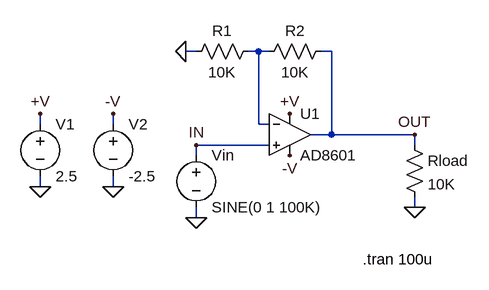
[diagram p0: schematic AD8601.asc]
AD8601.asc, the LTspice schematic file:
Version 4
SHEET 1 1240 700
WIRE 448 -1104 432 -1104
WIRE 544 -1104 528 -1104
WIRE 560 -1104 544 -1104
WIRE 656 -1104 640 -1104
WIRE 208 -992 208 -1008
WIRE 320 -992 320 -1008
WIRE 544 -992 544 -1104
WIRE 560 -992 544 -992
WIRE 656 -976 656 -1104
WIRE 656 -976 624 -976
WIRE 784 -976 656 -976
WIRE 560 -960 448 -960
WIRE 784 -960 784 -976
WIRE 448 -944 448 -960
WIRE 208 -896 208 -912
WIRE 320 -896 320 -912
WIRE 784 -864 784 -880
WIRE 448 -848 448 -864
FLAG 208 -1008 +V
FLAG 208 -896 0
FLAG 448 -848 0
FLAG 784 -976 OUT
FLAG 448 -960 IN
FLAG 592 -1008 +V
FLAG 320 -1008 -V
FLAG 592 -944 -V
FLAG 432 -1104 0
FLAG 784 -864 0
FLAG 320 -896 0
SYMBOL voltage 448 -960 R0
WINDOW 123 24 146 Left 2
WINDOW 39 24 125 Left 2
SYMATTR InstName Vin
SYMATTR Value SINE(0 1 100K)
SYMBOL Opamps\\AD8601 592 -1040 R0
SYMATTR InstName U1
SYMBOL voltage 208 -1008 R0
WINDOW 123 0 0 Left 2
WINDOW 39 0 0 Left 2
SYMATTR InstName V1
SYMATTR Value 2.5
SYMBOL res 544 -1120 R90
WINDOW 0 0 56 VBottom 2
WINDOW 3 32 56 VTop 2
SYMATTR InstName R1
SYMATTR Value 10K
SYMBOL res 656 -1120 R90
WINDOW 0 0 56 VBottom 2
WINDOW 3 32 56 VTop 2
SYMATTR InstName R2
SYMATTR Value 10K
SYMBOL voltage 320 -1008 R0
WINDOW 123 24 146 Left 2
WINDOW 39 24 125 Left 2
SYMATTR InstName V2
SYMATTR Value -2.5
SYMBOL res 768 -976 R0
SYMATTR InstName Rload
SYMATTR Value 10K
TEXT 704 -784 Left 2 !.tran 100u

The netlist it stands for:
* AD8601.asc
Vin IN 0 SINE(0 1 100K)
XU1 IN N001 +V -V OUT AD8601  ; pins In+ In- V+ V- OUT
V1 +V 0 2.5
R1 N001 0 10K
R2 OUT N001 10K
V2 -V 0 -2.5
Rload OUT 0 10K
.tran 100u
.backanno
.end